# EAGLE design TREM_STM (EAGLE 9.2.2)
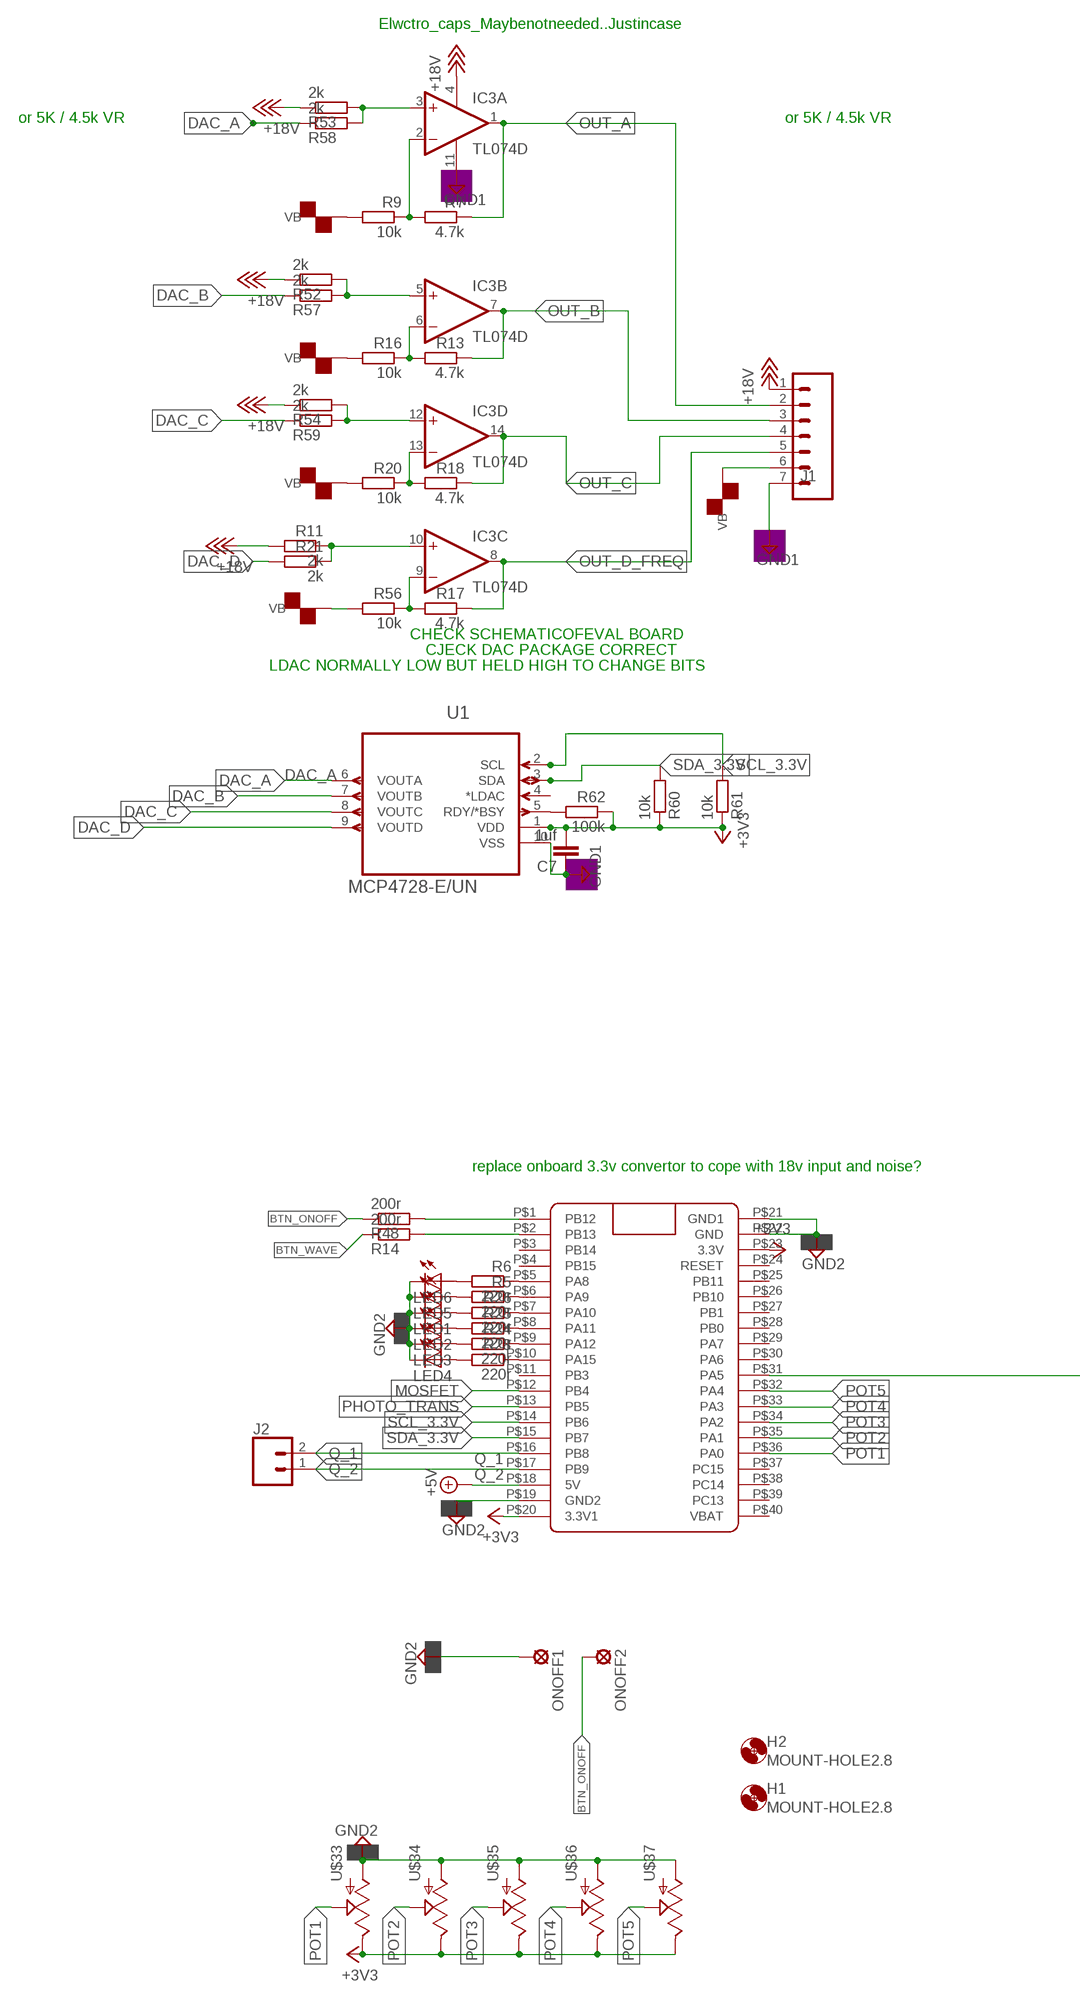
[diagram p0: schematic, sheet 1, part 1 of 2]
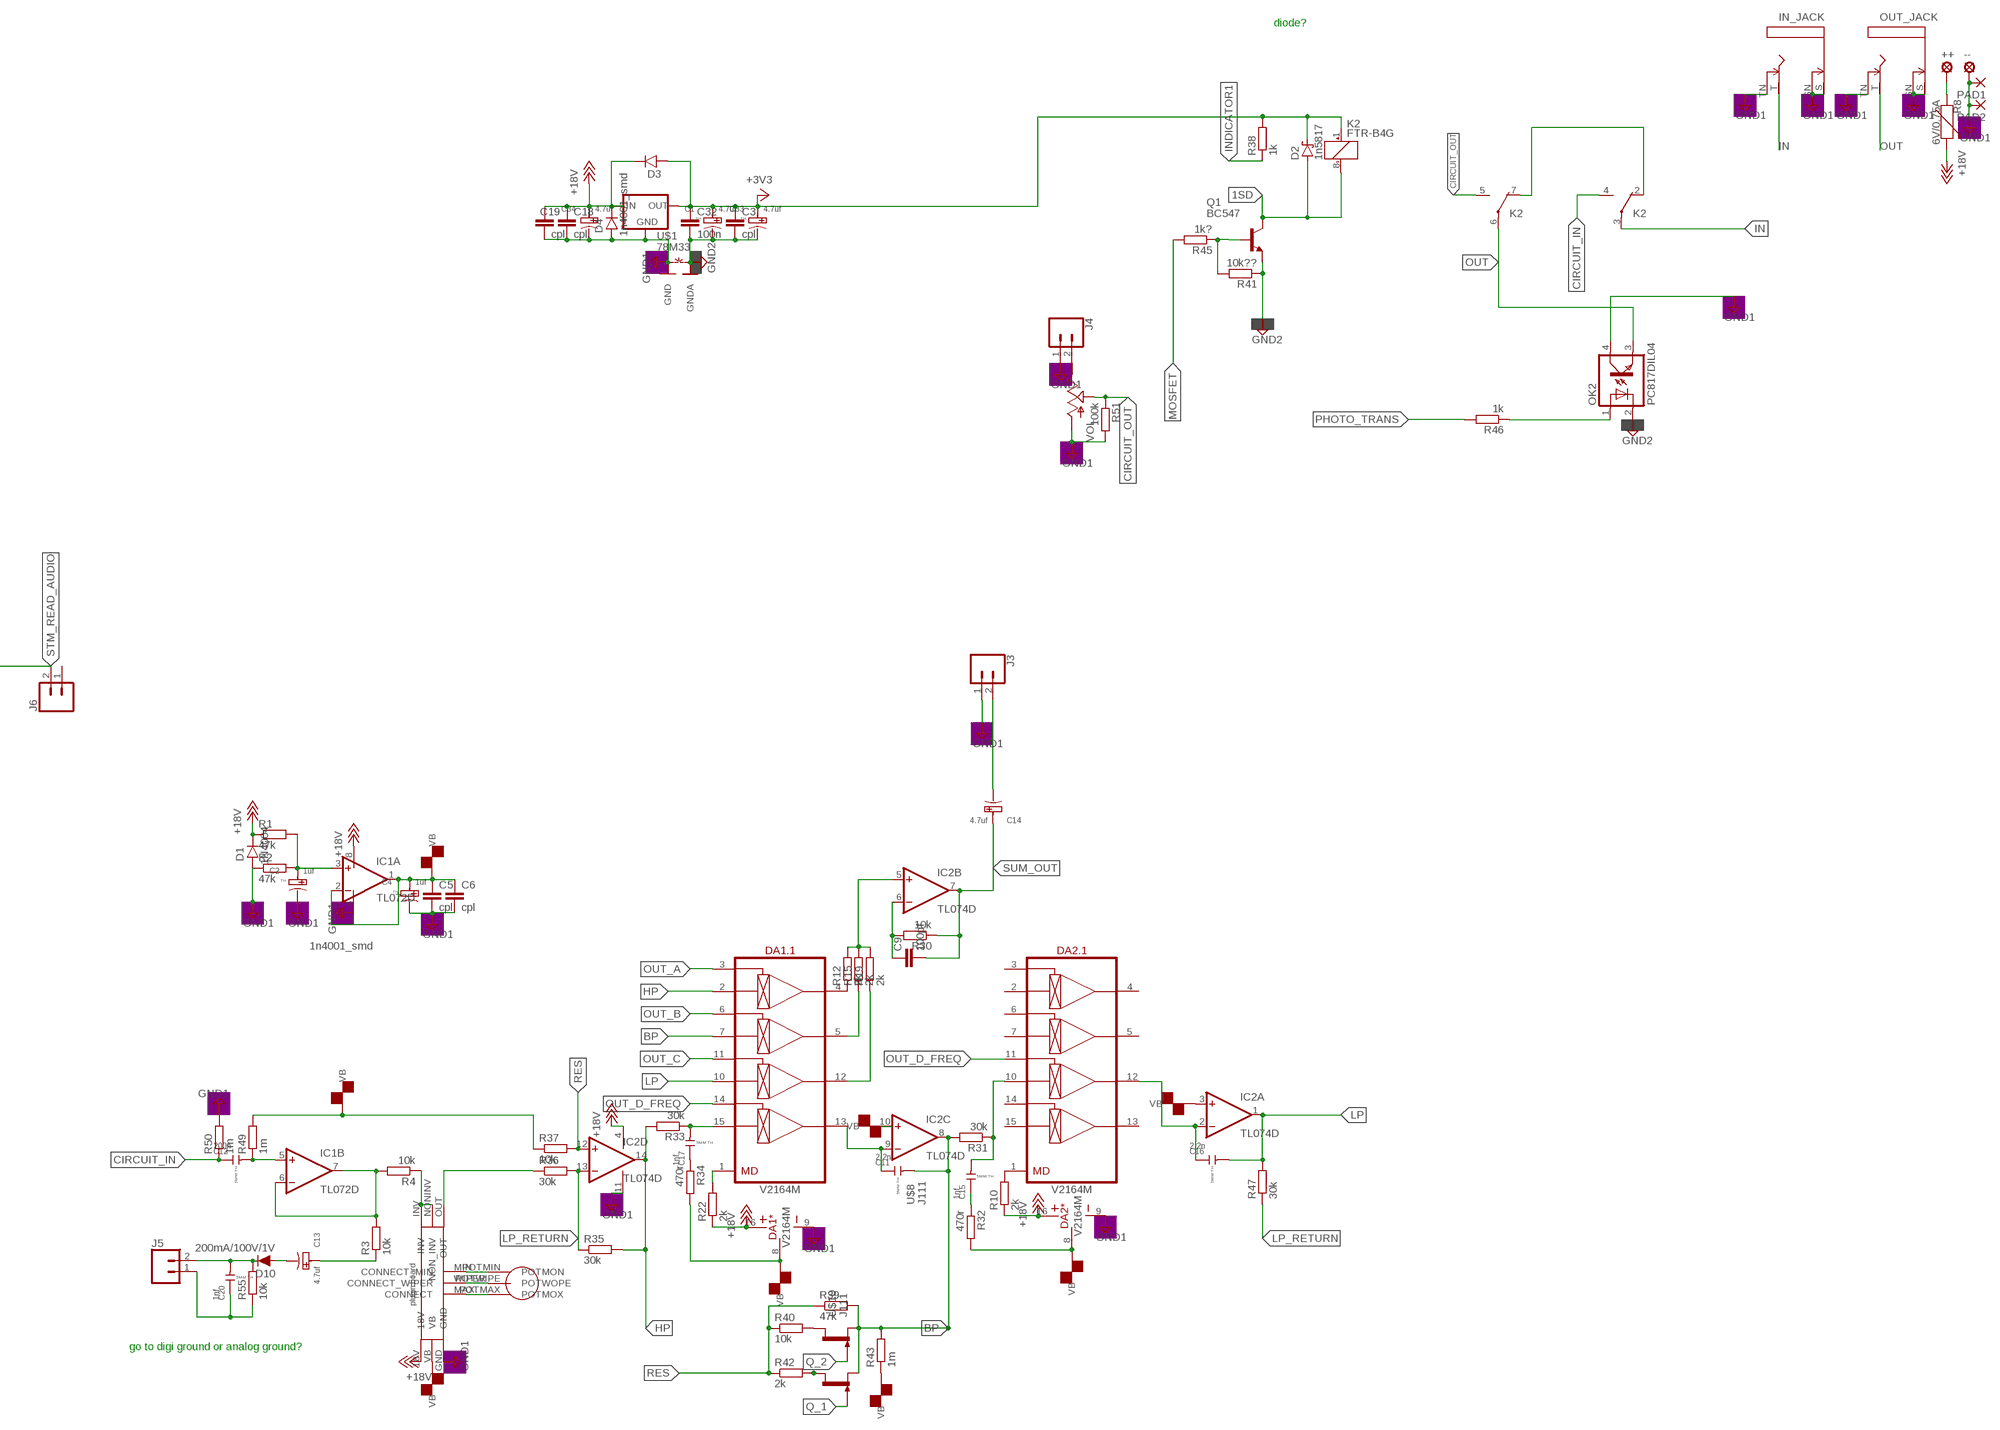
[diagram p1: schematic, sheet 1, part 2 of 2]

## Parts
++  LSP10  [LSP10]
--  LSP10  [LSP10]
C1  4.7uf  THRU-HOLE-POLARIZED  [PC-D5.3MM]
C2  1uf  THRU-HOLE-POLARIZED  [PC-D5.3MM]
C3  cpl  C-EUC1206  [C1206]
C4  1uf  THRU-HOLE-POLARIZED  [PC-D5.3MM]
C5  cpl  C-EUC1206  [C1206]
C6  cpl  C-EUC1206  [C1206]
C7  1uf  C-EUC1206  [C1206]
C9  100pf  C-EUC1206  [C1206]
C11  2.2n  THRU_HOLE_5MM_SPACING  [CERAMIC-5MM]
C12  200n  THRU_HOLE_5MM_SPACING  [CERAMIC-5MM]
C13  4.7uf  THRU-HOLE-POLARIZED  [PC-D5.3MM]
C14  4.7uf  THRU-HOLE-POLARIZED  [PC-D5.3MM]
C15  1nf  THRU_HOLE_5MM_SPACING  [CERAMIC-5MM]
C16  2.2n  THRU_HOLE_5MM_SPACING  [CERAMIC-5MM]
C17  1nf  THRU_HOLE_5MM_SPACING  [CERAMIC-5MM]
C18  cpl  C-EUC1206  [C1206]
C19  cpl  C-EUC1206  [C1206]
C20  1nf  THRU_HOLE_5MM_SPACING  [CERAMIC-5MM]
C32  100n  C-EUC1206  [C1206]
C33  4.7uf  THRU-HOLE-POLARIZED  [PC-D5.3MM]
C34  4.7uf  THRU-HOLE-POLARIZED  [PC-D5.3MM]
D1  1N4004  1N400X.1  [DO41-1]
D2  1n5817  SCHOTTKY-DIODESMD  [SMB]
D3  1n4001_smd  1N400X.1  [DO41-1]
D4  1n4001_smd  1N400X.1  [DO41-1]
D10  200mA/100V/1V  DIODE-1N4148  [DIODE-1N4148]
DA1  V2164M  [SO-16]
DA2  V2164M  [SO-16]
H1  MOUNT-HOLE2.8  [2,8]
H2  MOUNT-HOLE2.8  [2,8]
IC1  TL072D  [SO08]
IC2  TL074D  [SO14]
IC3  TL074D  [SO14]
IN_JACK  MMMONNNNOHOLES  [MONONOHOLES]
J1  CONN_07LONGPADS  [1X07_LONGPADS]
J2  CONN_02PTH3  [1X02_LONGPADS]
J3  CONN_02PTH3  [1X02_LONGPADS]
J4  CONN_02PTH3  [1X02_LONGPADS]
J5  CONN_02PTH3  [1X02_LONGPADS]
J6  CONN_02PTH3  [1X02_LONGPADS]
K2  FTR-B4G  [FTR-B4G]
LED1  LED3MM  [LED3MM]
LED2  LED3MM  [LED3MM]
LED3  LED3MM  [LED3MM]
LED4  LED3MM  [LED3MM]
LED5  LED3MM  [LED3MM]
LED6  LED3MM  [LED3MM]
OK2  PC817DIL04  [SMD4]
ONOFF1  LSP10  [LSP10]
ONOFF2  LSP10  [LSP10]
OUT_JACK  MMMONNNNOHOLES  [MONONOHOLES]
PAD1  SMD5  [SMD2,54-5,08]
PAD2  SMD5  [SMD2,54-5,08]
Q1  BC547  [TO92]
R1  47k  R-EU_M1206  [M1206]
R2  47k  R-EU_M1206  [M1206]
R3  10k  R-EU_M1206  [M1206]
R4  10k  R-EU_M1206  [M1206]
R5  220r  R-EU_M1206  [M1206]
R6  220r  R-EU_M1206  [M1206]
R7  4.7k  R-EU_M1206  [M1206]
R8  6V/0.75A  PPTC_THREE-QUARTER-AMP  [1206]
R9  10k  R-EU_M1206  [M1206]
R10  2k  R-EU_M1206  [M1206]
R11  2k  R-EU_M1206  [M1206]
R12  2k  R-EU_M1206  [M1206]
R13  4.7k  R-EU_M1206  [M1206]
R14  200r  R-EU_M1206  [M1206]
R15  2k  R-EU_M1206  [M1206]
R16  10k  R-EU_M1206  [M1206]
R17  4.7k  R-EU_M1206  [M1206]
R18  4.7k  R-EU_M1206  [M1206]
R19  2k  R-EU_M1206  [M1206]
R20  10k  R-EU_M1206  [M1206]
R21  2k  R-EU_M1206  [M1206]
R22  2k  R-EU_M1206  [M1206]
R23  220r  R-EU_M1206  [M1206]
R24  220r  R-EU_M1206  [M1206]
R25  220r  R-EU_M1206  [M1206]
R26  220r  R-EU_M1206  [M1206]
R30  10k  R-EU_M1206  [M1206]
R31  30k  R-EU_M1206  [M1206]
R32  470r  R-EU_M1206  [M1206]
R33  30k  R-EU_M1206  [M1206]
R34  470r  R-EU_M1206  [M1206]
R35  30k  R-EU_M1206  [M1206]
R36  30k  R-EU_M1206  [M1206]
R37  10k  R-EU_M1206  [M1206]
R38  1k  R-EU_M1206  [M1206]
R39  47k  R-EU_M1206  [M1206]
R40  10k  R-EU_M1206  [M1206]
R41  10k??  R-EU_M1206  [M1206]
R42  2k  R-EU_M1206  [M1206]
R43  1m  R-EU_M1206  [M1206]
R45  1k?  R-EU_M1206  [M1206]
R46  1k  R-EU_M1206  [M1206]
R47  30k  R-EU_M1206  [M1206]
R48  200r  R-EU_M1206  [M1206]
R49  1m  R-EU_M1206  [M1206]
R50  1m  R-EU_M1206  [M1206]
R51  100k  R-EU_M1206  [M1206]
R52  2k  R-EU_M1206  [M1206]
R53  2k  R-EU_M1206  [M1206]
R54  2k  R-EU_M1206  [M1206]
R55  10k  R-EU_M1206  [M1206]
R56  10k  R-EU_M1206  [M1206]
R57  2k  R-EU_M1206  [M1206]
R58  2k  R-EU_M1206  [M1206]
R59  2k  R-EU_M1206  [M1206]
R60  10k  R-EU_M1206  [M1206]
R61  10k  R-EU_M1206  [M1206]
R62  100k  R-EU_M1206  [M1206]
U1  MCP4728-E/UN  [SOP50P490X110-10N]
U$1  78M33  [SOT223]
U$8  J111  [TO92-]
U$10  J111  [TO92-]
U$11  BLUE_PILL  [BLUE_PILL]
U$32  GT_PLUGIN  [PLUGIN_RECIEVE]
U$33  POT  [ALPS_POT]
U$34  POT  [ALPS_POT]
U$35  POT  [ALPS_POT]
U$36  POT  [ALPS_POT]
U$37  POT  [ALPS_POT]
VOL  POT  [ALPS_POT]
~NUDEV~1  GND-GNDA1,27MM  [GND-GNDA-1,27MM]

## Nets
1SD: D2.A K2.8(K:-) Q1.3(C)
+3V3: C1.+ C3.1 C7.2 C32.1 C33.+ D2.C D3.A K2.1(K:+) R38.2 R60.1 R61.1 R62.1 U1.1(VDD) U$1.3(OUT) U$11.P$20(3.3V1) U$11.P$23(3.3V) U$33.P$1(E) U$34.P$1(E) U$35.P$1(E) U$36.P$1(E) U$37.P$1(E)
+5V: U$11.P$18(5V)
+18V: C18.1 C19.1 C34.+ D1.C D3.C D4.C DA1.16(*:V+) DA2.16(*:V+) IC1.8(P:V+) IC2.4(P:V+) IC3.4(P:V+) J1.1 R1.1 R8.2 R10.1 R11.2 R22.1 R52.1 R53.1 R54.1 U$1.1(IN) U$32.18V
BP: C11.2 DA1.7(.1:IN2) IC2.8(C:OUT) R31.2 R39.2 R43.2 U$8.2(S) U$10.2(S)
BTN_ONOFF: ONOFF2.MP R48.1
BTN_WAVE: R14.1
CIRCUIT_IN: C12.1 K2.4(-1:S) R50.1
CIRCUIT_OUT: K2.5(-2:S) R51.1 VOL.P$2(S)
DAC_A: R58.1 U1.6(VOUTA)
DAC_B: R57.1 U1.7(VOUTB)
DAC_C: R59.1 U1.8(VOUTC)
DAC_D: R21.2 U1.9(VOUTD)
GND1: --.MP C2.- C4.- C5.2 C6.2 C7.1 C18.2 C19.2 C34.- D1.A D4.A DA1.9(*:V-) DA2.9(*:V-) IC1.4(P:V-) IC2.11(P:V-) IC3.11(P:V-) IN_JACK.S IN_JACK.SN IN_JACK.TN J1.7 J3.1 J4.1 OK2.4(COL) OUT_JACK.S OUT_JACK.SN OUT_JACK.TN PAD1.1(P) PAD2.1(P) R2.1 R50.2 U1.10(VSS) U$1.2(GND) U$1.4(GND) U$32.GND ~NUDEV~1.GND
GND2: C1.- C3.2 C32.2 C33.- LED1.K(C) LED2.K(C) LED3.K(C) LED4.K(C) LED5.K(C) LED6.K(C) OK2.2(C) ONOFF1.MP Q1.1(E) R41.1 U$11.P$19(GND2) U$11.P$21(GND1) U$11.P$22(GND) U$33.P$3(A) U$34.P$3(A) U$35.P$3(A) U$36.P$3(A) U$37.P$3(A) ~NUDEV~1.GNDA
HP: DA1.2(.1:IN1) IC2.14(D:OUT) R33.2 R35.2
IN: IN_JACK.T K2.3(-1:P)
INDICATOR1: R38.1
LP: C16.2 DA1.10(.1:IN3) IC2.1(A:OUT) R47.2
LP_RETURN: IC2.13(D:-IN) R35.1 R36.2 R47.1
MOSFET: R45.2 U$11.P$12(PB4)
N$1: IC3.2(A:-IN) R7.2 R9.1
N$2: C2.+ IC1.3(A:+IN) R1.2 R2.2
N$3: DA1.1(.1:MD) R22.2
N$4: IC3.3(A:+IN) R53.2 R58.2
N$5: IC3.5(B:+IN) R52.2 R57.2
N$6: IC3.6(B:-IN) R13.2 R16.1
N$7: DA2.1(.1:MD) R10.2
N$8: IC3.12(D:+IN) R54.2 R59.2
N$9: IC3.10(C:+IN) R11.1 R21.1
N$10: IC3.13(D:-IN) R18.2 R20.1
N$11: DA1.4(.1:OUT1) R12.1
N$12: R62.2 U1.5(RDY/*BSY)
N$13: IC3.9(C:-IN) R17.2 R56.1
N$14: DA1.5(.1:OUT2) R15.1
N$15: DA1.12(.1:OUT3) R19.1
N$16: IC1.6(B:-IN) IC1.7(B:OUT) R3.2 R4.2
N$17: R23.1 U$11.P$10(PA15)
N$18: R24.1 U$11.P$9(PA12)
N$19: R25.1 U$11.P$8(PA11)
N$20: IC2.5(B:+IN) R12.2 R15.2 R19.2
N$21: C9.1 IC2.6(B:-IN) R30.2
N$22: R26.1 U$11.P$7(PA10)
N$23: R36.1 U$32.OUT
N$24: C11.1 DA1.13(.1:OUT4) IC2.9(C:-IN)
N$25: R40.2 U$10.3(D)
N$26: C15.2 DA2.10(.1:IN3) R31.1
N$27: C15.1 R32.1
N$28: C16.1 DA2.12(.1:OUT3) IC2.2(A:-IN)
N$29: R42.2 U$8.3(D)
N$30: C17.2 DA1.15(.1:IN4) R33.1
N$31: LED1.A R26.2
N$32: R4.1 U$32.INV U$32.NONINV(NON_INV)
N$33: U$32.MIN(CONNECT_MIN) U$32.POTMIN(POTMON)
N$34: U$32.POTWIPE(POTWOPE) U$32.WIPER(CONNECT_WIPER)
N$35: U$32.MAX(CONNECT) U$32.POTMAX(POTMOX)
N$36: LED2.A R25.2
N$37: K2.2(-1:O) K2.7(-2:O)
N$38: LED3.A R24.2
N$39: LED4.A R23.2
N$40: J4.2 VOL.P$1(E)
N$41: ++.MP R8.1
N$42: C17.1 R34.1
N$43: C12.2 IC1.5(B:+IN) R49.1
N$44: C13.- D10.A
N$45: R51.2 VOL.P$3(A) ; supply symbol labelled GND1
N$46: C13.+ R3.1
N$47: R48.2 U$11.P$1(PB12)
N$48: R14.2 U$11.P$2(PB13)
N$49: R5.1 U$11.P$6(PA9)
N$50: R6.1 U$11.P$5(PA8)
N$51: LED5.A R5.2
N$52: LED6.A R6.2
N$53: C20.1 J5.1 R55.1
N$84: Q1.2(B) R41.2 R45.1
N$88: OK2.1(A) R46.1
OUT: K2.6(-2:P) OK2.3(EMIT) OUT_JACK.T
OUT_A: DA1.3(.1:CV1) IC3.1(A:OUT) J1.2 R7.1
OUT_B: DA1.6(.1:CV2) IC3.7(B:OUT) J1.3 R13.1
OUT_C: DA1.11(.1:CV3) IC3.14(D:OUT) J1.4 R18.1
OUT_D_FREQ: DA1.14(.1:CV4) DA2.11(.1:CV3) IC3.8(C:OUT) J1.5 R17.1
PHOTO_TRANS: R46.2 U$11.P$13(PB5)
POT1: U$11.P$36(PA0) U$33.P$2(S)
POT2: U$11.P$35(PA1) U$34.P$2(S)
POT3: U$11.P$34(PA2) U$35.P$2(S)
POT4: U$11.P$33(PA3) U$36.P$2(S)
POT5: U$11.P$32(PA4) U$37.P$2(S)
Q_1: J2.2 U$8.1(G) U$11.P$16(PB8)
Q_2: J2.1 U$10.1(G) U$11.P$17(PB9)
READ: C14.- J3.2
RES: IC2.12(D:+IN) R37.2 R39.1 R40.1 R42.1
SCL_3.3V: R61.2 U1.2(SCL) U$11.P$14(PB6)
SDA_3.3V: R60.2 U1.3(SDA) U$11.P$15(PB7)
STM_READ_AUDIO: C20.2 D10.C J5.2 J6.2 R55.2 U$11.P$31(PA5)
SUM_OUT: C9.2 C14.+ IC2.7(B:OUT) R30.1
VB: C4.+ C5.1 C6.1 DA1.8(*:GND) DA2.8(*:GND) IC1.1(A:OUT) IC1.2(A:-IN) IC2.3(A:+IN) IC2.10(C:+IN) J1.6 R9.2 R16.2 R20.2 R32.2 R34.2 R37.1 R43.1 R49.2 R56.2 U$32.VB
Unconnected: DA2.2(.1:IN1) DA2.3(.1:CV1) DA2.4(.1:OUT1) DA2.5(.1:OUT2) DA2.6(.1:CV2) DA2.7(.1:IN2) DA2.13(.1:OUT4) DA2.14(.1:CV4) DA2.15(.1:IN4) J6.1 U1.4(*LDAC) U$11.P$3(PB14) U$11.P$4(PB15) U$11.P$11(PB3) U$11.P$24(RESET) U$11.P$25(PB11) U$11.P$26(PB10) U$11.P$27(PB1) U$11.P$28(PB0) U$11.P$29(PA7) U$11.P$30(PA6) U$11.P$37(PC15) U$11.P$38(PC14) U$11.P$39(PC13) U$11.P$40(VBAT)

## Notes on the sheet
- Elwctro_caps_Maybenotneeded..Justincase
- or 5K / 4.5k VR | or 5K / 4.5k VR
- diode?
- CHECK SCHEMATICOFEVAL BOARD
- CJECK DAC PACKAGE CORRECT
- LDAC NORMALLY LOW BUT HELD HIGH TO CHANGE BITS
- replace onboard 3.3v convertor to cope with 18v input and noise?
- go to digi ground or analog ground?

## Library data of the parts
++ -- ONOFF1 ONOFF2 = solpad:LSP10: SOLDER PAD drill 1.0 mm, distributor Buerklin, 12H555
C1 C2 C4 C13 C14 C33 C34 = GT_Capacitor:THRU-HOLE-POLARIZED: 302030033; PACKAGE: TH
C3 C5-C7 C9 C18 C19 C32 = resistor:C-EU: CAPACITOR, European symbol
C11 C12 C15-C17 C20 = GT_Capacitor:THRU_HOLE_5MM_SPACING: 302010202; PACKAGE: 5MM TH
D1 D3 D4 = gm-diodes:1N400X: Rectifier Diodes often used in power supply to prevent damage from reverse polarization
D2 = diode:SCHOTTKY-DIODE: Schottky Diode
D10 = SparkFun-DiscreteSemi:DIODE: Diode These are standard reverse protection diodes and small signal diodes. SparkFun Products: SparkFun SparkPunk Sound Kit <https://www.sparkfun.com/products/11177> SparkFun ESP8266 Thing <https://www.sparkfun.com/products/13231>; PROD_ID: DIO-08378
DA1 DA2 = ic-coolaudio:V2164
H1 H2 = holes:MOUNT-HOLE: MOUNTING HOLE with drill center marker
IC1 = linear:TL072: OP AMP
IC2 IC3 = linear:TL074: OP AMP
IN_JACK OUT_JACK = gm-jacks2:MMMONNN
J1 = GT_Connectors:CONN_07: Multi connection point. Often used as Generic Header-pin footprint for 0.1 inch spaced/style header connections On any of the 0.1 inch spaced packages, you can populate with these: Break Away Headers - Straight <https://www.sparkfun.com/products/116> (PRT-00116) Break Away Male Headers - Right Angle <https://www.sparkfun.com/products/553> (PRT-00553) Female Headers <https://www.sparkfun.com/products/115> (PRT-00115) Break Away Headers - Machine Pin <https://www.sparkfun.com/products/117> (PRT-00117) Break Away Female Headers - Swiss Machine Pin <https://www.sparkfun.com/products/743> (PRT-00743) For SCREWTERMINALS and SPRING TERMINALS visit here: Screw Terimnals on SparkFun.com <https://www.sparkfun.com/search/results?term=Screw+Terminals> (5mm/3.5mm/2.54mm spacing) This device is also useful as a general connection point to wire up your design to another part of your project. Our various solder wires solder well into these plated through hole pads. Hook-Up Wire - Assortment (Stranded, 22 AWG) <https://www.sparkfun.com/products/11375> (PRT-11375) Hook-Up Wire - Assortment (Solid Core, 22 AWG) <https://www.sparkfun.com/products/11367> (PRT-11367) View the entire wire category on our website here <https://www.sparkfun.com/categories/141> Special notes: Molex polarized connector foot print use with SKU : PRT-08231 with associated crimp pins and housings. 1MM SMD Version SKU: PRT-10208 NOTES ON THE VARIANTS LOCK and LOCK_LONGPADS... This footprint was designed to help hold the alignment of a through-hole component (i.e. 6-pin header) while soldering it into place. You may notice that each hole has been shifted either up or down by 0.005 of an inch from it's more standard position (which is a perfectly straight line). This slight alteration caused the pins (the squares in the middle) to touch the edges of the holes. Because they are alternating, it causes a "brace" to hold the component in place. 0.005 has proven to be the perfect amount of "off-center" position when using our standard breakaway headers. Although looks a little odd when you look at the bare footprint, once you have a header in there, the alteration is very hard to notice. Also,if you push a header all the way into place, it is covered up entirely on the bottom side.
J2-J6 = GT_Connectors:CONN_02: Multi connection point. Often used as Generic Header-pin footprint for 0.1 inch spaced/style header connections On any of the 0.1 inch spaced packages, you can populate with these: Break Away Headers - Straight <https://www.sparkfun.com/products/116> (PRT-00116) Break Away Male Headers - Right Angle <https://www.sparkfun.com/products/553> (PRT-00553) Female Headers <https://www.sparkfun.com/products/115> (PRT-00115) Break Away Headers - Machine Pin <https://www.sparkfun.com/products/117> (PRT-00117) Break Away Female Headers - Swiss Machine Pin <https://www.sparkfun.com/products/743> (PRT-00743) For SCREWTERMINALS and SPRING TERMINALS visit here: Screw Terimnals on SparkFun.com <https://www.sparkfun.com/search/results?term=Screw+Terminals> (5mm/3.5mm/2.54mm spacing) This device is also useful as a general connection point to wire up your design to another part of your project. Our various solder wires solder well into these plated through hole pads. Hook-Up Wire - Assortment (Stranded, 22 AWG) <https://www.sparkfun.com/products/11375> (PRT-11375) Hook-Up Wire - Assortment (Solid Core, 22 AWG) <https://www.sparkfun.com/products/11367> (PRT-11367) View the entire wire category on our website here <https://www.sparkfun.com/categories/141> Special notes: Molex polarized connector foot print use with: PRT-08233 with associated crimp pins and housings. 2.54_SCREWTERM for use with PRT-10571. 3.5mm Screw Terminal footprints for PRT-08084 5mm Screw Terminal footprints for use with PRT-08432
K2 = relay:FTR-B4: ULTRA MINIATURE RELAY 2 POLES - 2 A (Slim Profile Signal Relay) FUJITSU FTR-B4 SERIES Source: FTR-B4.pdf
LED1-LED6 = GOLDTOOTH_LED:LED: LED OSRAM: - CHIPLED LG R971, LG N971, LY N971, LG Q971, LY Q971, LO R971, LY R971 LH N974, LH R974 LS Q976, LO Q976, LY Q976 LO Q996 - Hyper CHIPLED LW Q18S LB Q993, LB Q99A, LB R99A - SideLED LS A670, LO A670, LY A670, LG A670, LP A670 LB A673, LV A673, LT A673, LW A673 LH A674 LY A675 LS A676, LA A676, LO A676, LY A676, LW A676 LS A679, LY A679, LG A679 - Hyper Micro SIDELED® LS Y876, LA Y876, LO Y876, LY Y876 LT Y87S - SmartLED LW L88C, LW L88S LB L89C, LB L89S, LG L890 LS L89K, LO L89K, LY L89K LS L896, LA L896, LO L896, LY L896 - TOPLED LS T670, LO T670, LY T670, LG T670, LP T670 LSG T670, LSP T670, LSY T670, LOP T670, LYG T670 LG T671, LOG T671, LSG T671 LB T673, LV T673, LT T673, LW T673 LH T674 LS T676, LA T676, LO T676, LY T676, LB T676, LH T676, LSB T676, LW T676 LB T67C, LV T67C, LT T67C, LS T67K, LO T67K, LY T67K, LW E67C LS E67B, LA E67B, LO E67B, LY E67B, LB E67C, LV E67C, LT E67C LW T67C LS T679, LY T679, LG T679 LS T770, LO T770, LY T770, LG T770, LP T770 LB T773, LV T773, LT T773, LW T773 LH T774 LS E675, LA E675, LY E675, LS T675 LS T776, LA T776, LO T776, LY T776, LB T776 LHGB T686 LT T68C, LB T68C - Hyper Mini TOPLED® LB M676 - Mini TOPLED Santana® LG M470 LS M47K, LO M47K, LY M47K Source: http://www.osram.convergy.de LUXEON: - LUMILED® LXK2-PW12-R00, LXK2-PW12-S00, LXK2-PW14-U00, LXK2-PW14-V00 LXK2-PM12-R00, LXK2-PM12-S00, LXK2-PM14-U00 LXK2-PE12-Q00, LXK2-PE12-R00, LXK2-PE12-S00, LXK2-PE14-T00, LXK2-PE14-U00 LXK2-PB12-K00, LXK2-PB12-L00, LXK2-PB12-M00, LXK2-PB14-N00, LXK2-PB14-P00, LXK2-PB14-Q00 LXK2-PR12-L00, LXK2-PR12-M00, LXK2-PR14-Q00, LXK2-PR14-R00 LXK2-PD12-Q00, LXK2-PD12-R00, LXK2-PD12-S00 LXK2-PH12-R00, LXK2-PH12-S00 LXK2-PL12-P00, LXK2-PL12-Q00, LXK2-PL12-R00 Source: www.luxeon.com KINGBRIGHT: KA-3528ASYC Source: www.kingbright.com
OK2 = GT_optocoupler:PC817: SHARP OPTO COUPLER
PAD1 PAD2 = wirepad:SMD5: SMD PAD
Q1 = transistor-npn:BC547*: NPN Transistor
R1-R7 R9-R26 R30-R43 R45-R62 = resistor:R-EU_: RESISTOR, European symbol
R8 = GOLDTOOTH-Fuses:PPTC: Resettable Fuse PPTC Resettable Fuse. Really a sort of resistor with a polymeric positive temperature coefficient whose resistance increases dramatically with an increase in temperature. When heated by the power passing through the resistance rises causing the current to be limited, protecting the circuit. This is achieved by the transition of the polymer from a crystalline to an amorphous state where the conductive carbon separates breaking the conductive pathways found in the cool crystalline structure. When a PPTC cools back down it resumes conducting letting the circuit turn back on. SparkFun Products: SparkFun RedBoard - Programmed with Arduino <https://www.sparkfun.com/products/12757> Pro Micro - 5V/16MHz <https://www.sparkfun.com/products/12640> Arduino Pro 328 - 5V/16MHz <https://www.sparkfun.com/products/10915> MP3 Trigger <https://www.sparkfun.com/products/13720>; PROD_ID: RES-11150
U1 = GD_MCP4728:MCP4728-E/UN: IC, DAC, 12BIT, QUAD; MPN: MCP4728-E/UN; OC_FARNELL: 1800217; OC_NEWARK: 08R1808; PACKAGE: MSOP-10; SUPPLIER: MICROCHIP
U$1 = v-reg-2:78M33
U$8 U$10 = fv1_bingo:J111
U$11 = BluePill:BLUE_PILL
U$32 = BluePill:GT_PLUGIN
U$33-U$37 VOL = SparkFun-Electromechanical:POT
~NUDEV~1 = ground-junctions:GND-GNDA: Connect GND - GNDA without DRC-Error, display layer 53 (54) to make copper (ROUTE) from GND to GNDA Select also layer 53 (54) in CAM-Job!

## Board
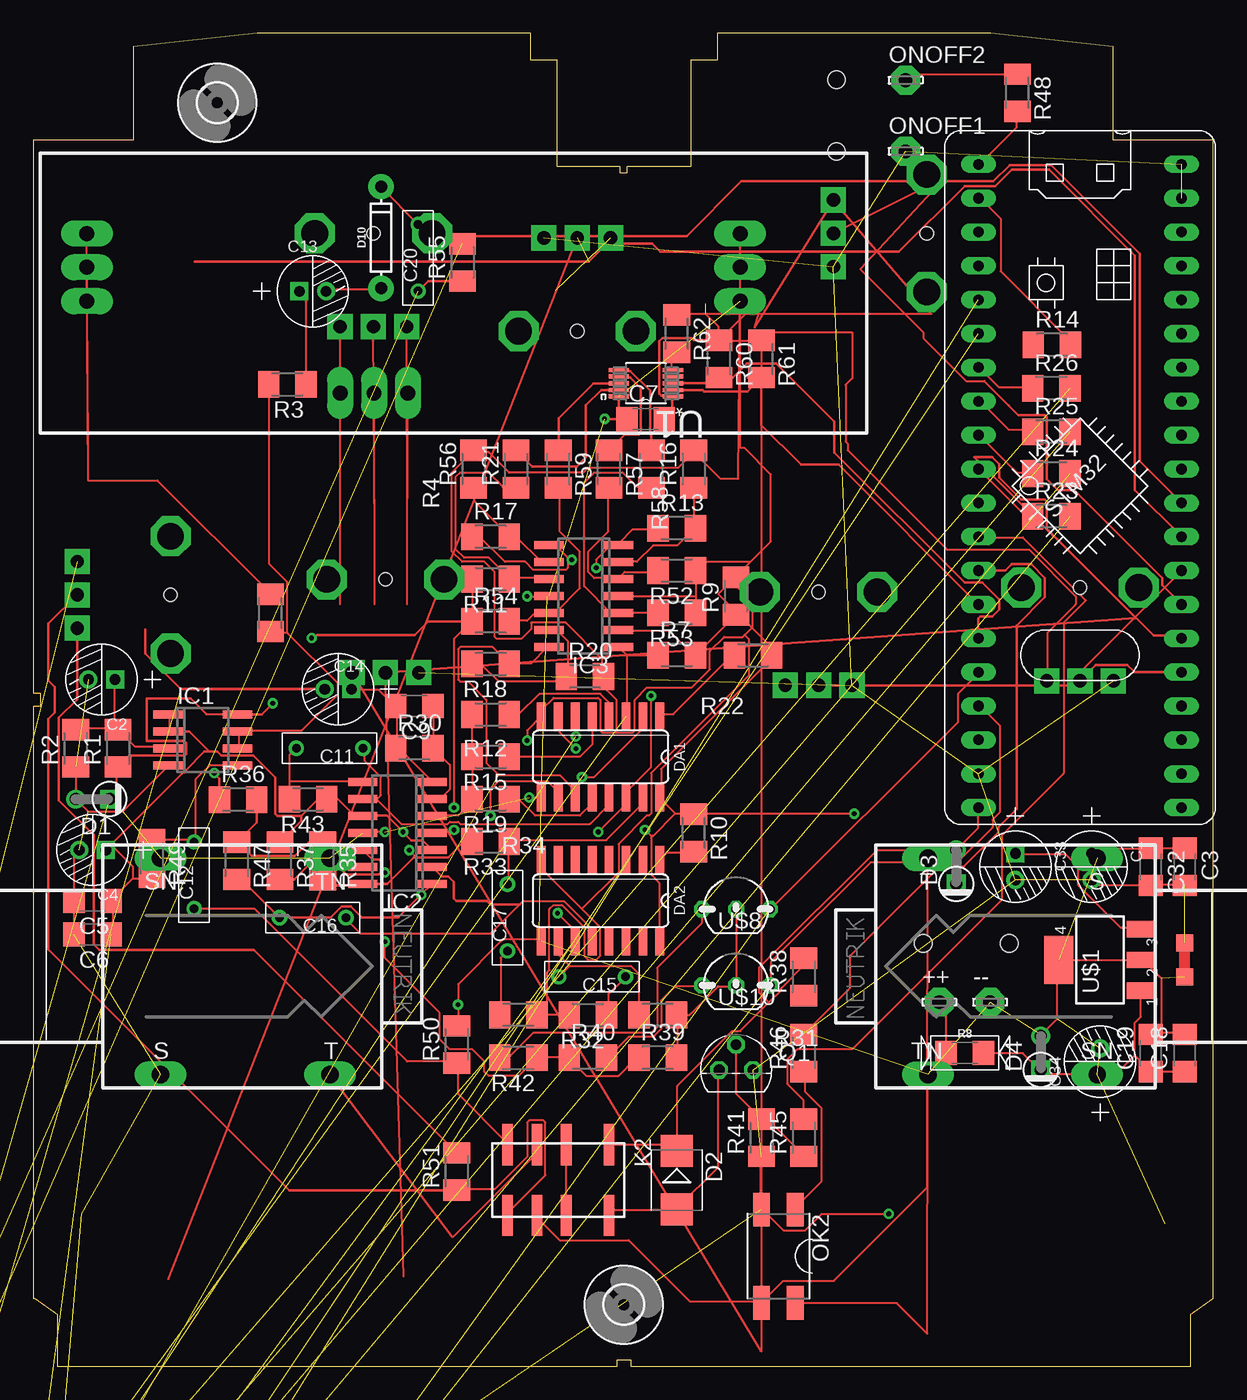
[diagram p2: board, top side]
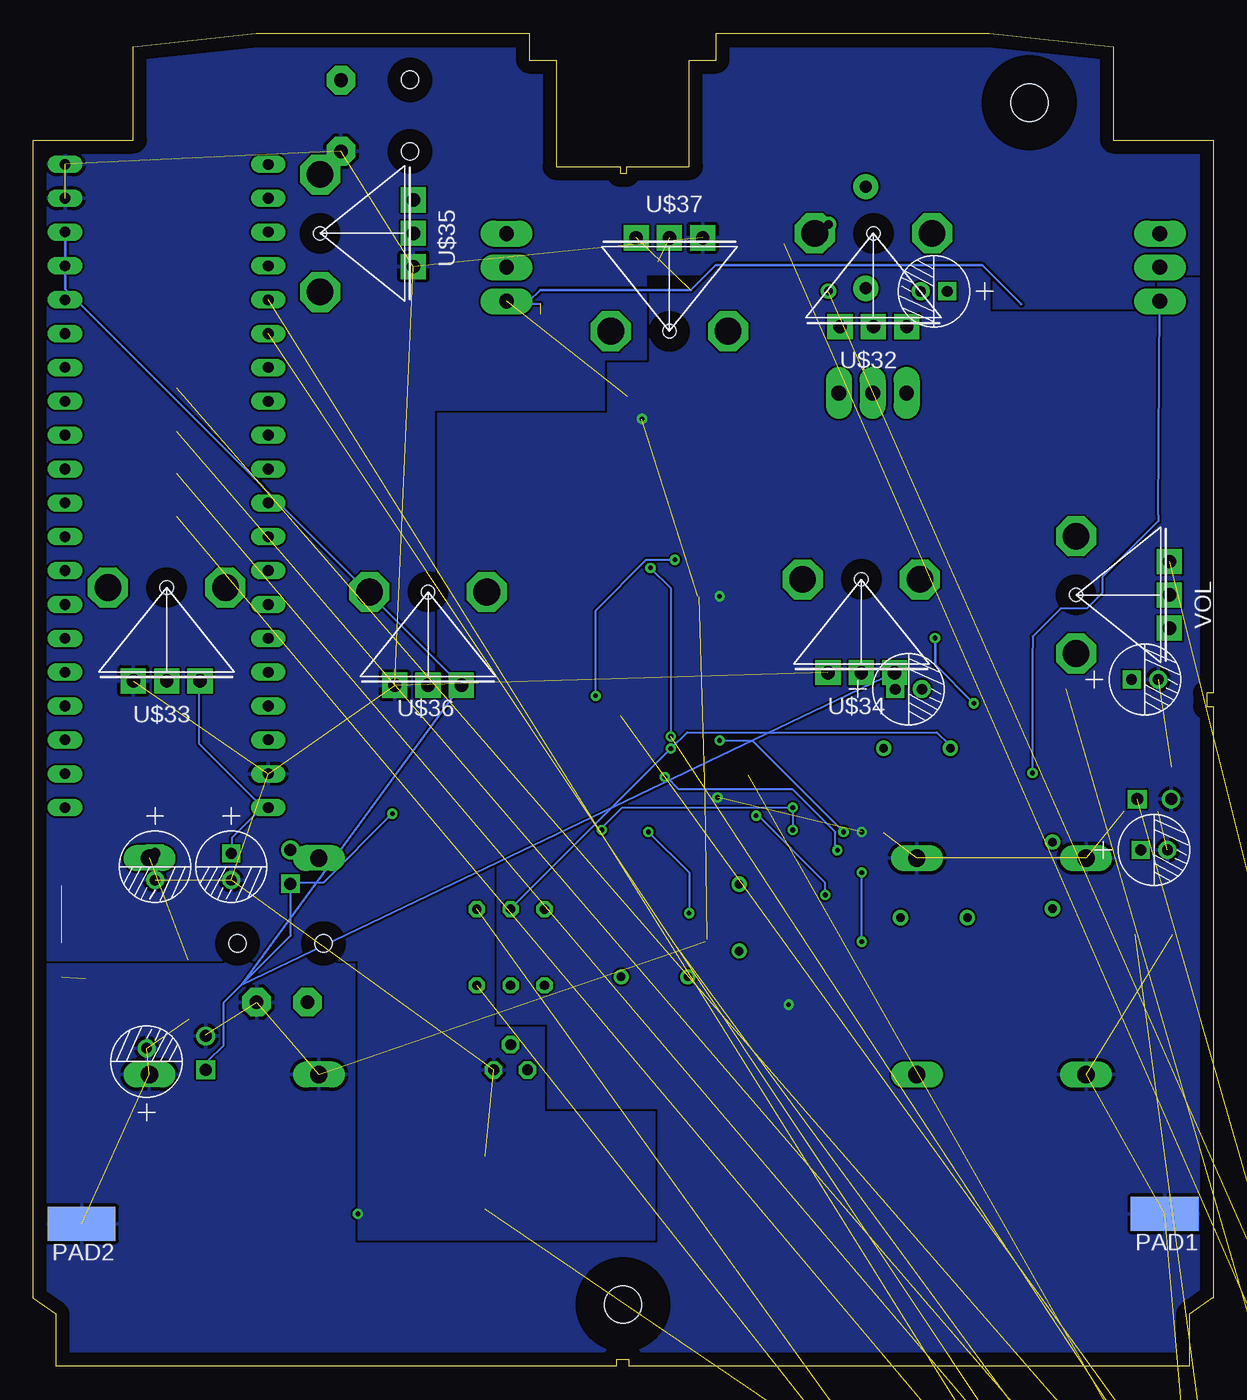
[diagram p3: board, bottom side, seen from below]

Size 88.5 x 100 mm. Coordinates in mm from the lower left corner, seen from the top.
Outline: 88.5,92 81,92 81,99 71.8,100 51.3,100 51.3,98 49.3,98 49.3,90 44.5,90 44.5,89.5 44,89.5 44,90 39.3,90 39.3,98 37.3,98 37.3,100 16.8,100 7.5,99 7.5,92 0,92 0,50.5 0.5,50.5 0.5,49.5 0,49.5 0,5.08 0.11,5.08 1.8,3.89 1.8,0 43.8,0 43.8,0.5 44.8,0.5 44.8,0 86.8,0 86.8,3.89 88.5,5.08 88.5,92
Copper layers (1*16): Top 0.035mm / dielectric 1.5mm / Bottom 0.035mm
Design rules "default": minimum track width 6mil, minimum drill 0.35mm, track to track 6mil, track to pad 6mil, pad to pad 6mil, via to via 6mil, smd to smd 6mil, copper to edge 40mil, drill to drill 6mil, minimum pad ring 10mil, minimum via ring 8mil, stop-mask expansion 4mil, vias tented up to drill 0mil, thermal gap 10mil

### Footprints (pad centres in the part's own frame; a part is rotated, then mirrored left to right if it is on the bottom)
LSP10 = drill 1.016 pad 2.159 octagon: MP 0,0
PC-D5.3MM = drill 0.8 pad 1.35 square: + -1,0 | drill 0.8 pad 1.35: - 1,0
C1206 = smd 1.6 x 1.8: 1 -1.4,0; 2 1.4,0
CERAMIC-5MM = drill 0.635 pad 1.143: 1 -2.5,0; 2 2.5,0
DO41-1 = drill 0.9: A 1.27,0 | drill 0.9 square: C -1.27,0
SMB = smd 2.4 x 2.4: A 2.2,0; C -2.2,0
DIODE-1N4148 = drill 0.9 pad 1.88: A -3.81,0; C 3.81,0
SO-16 = smd 0.66 x 2.032: 1 -4.445,-3.073; 2 -3.175,-3.073; 3 -1.905,-3.073; 4 -0.635,-3.073; 5 0.635,-3.073; 6 1.905,-3.073; 7 3.175,-3.073; 8 4.445,-3.073; 9 4.445,3.073; 10 3.175,3.073; 11 1.905,3.073; 12 0.635,3.073; 13 -0.635,3.073; 14 -1.905,3.073; 15 -3.175,3.073; 16 -4.445,3.073
2,8 = hole 2.8: 0,0
SO08 = smd 0.6 x 2.2: 1 -1.905,-2.6; 2 -0.635,-2.6; 3 0.635,-2.6; 4 1.905,-2.6; 5 1.905,2.6; 6 0.635,2.6; 7 -0.635,2.6; 8 -1.905,2.6
SO14 = smd 0.6 x 2.2: 1 -3.81,-2.6; 2 -2.54,-2.6; 3 -1.27,-2.6; 4 0,-2.6; 5 1.27,-2.6; 6 2.54,-2.6; 7 3.81,-2.6; 8 3.81,2.6; 9 2.54,2.6; 10 1.27,2.6; 11 0,2.6; 12 -1.27,2.6; 13 -2.54,2.6; 14 -3.81,2.6
MONONOHOLES = drill 1.3 long: S 6.35,8.115; SN 6.35,-8.115; T -6.35,8.115; TN -6.35,-8.115
1X07_LONGPADS = drill 1.016 pad 1.88 long: 1 0,0; 2 2.54,0; 3 5.08,0; 4 7.62,0; 5 10.16,0; 6 12.7,0; 7 15.24,0
1X02_LONGPADS = drill 1.118 pad 1.88 long: 1 0,0; 2 2.54,0
FTR-B4G = smd 0.8 x 3.1: 1 -3.8,-2.65; 2 -0.6,-2.65; 3 1.6,-2.65; 4 3.8,-2.65; 5 3.8,2.65; 6 1.6,2.65; 7 -0.6,2.65; 8 -3.8,2.65
LED3MM = drill 0.813 octagon: A -1.27,0; K 1.27,0
SMD4 = smd 1.27 x 2.54: 1 -1.27,-3.5; 2 1.27,-3.5; 3 1.27,3.5; 4 -1.27,3.5
SMD2,54-5,08 = smd 2.54 x 5.08: 1 0,0
TO92 = drill 0.813 octagon: 1 1.27,0; 2 0,1.905; 3 -1.27,0
M1206 = smd 1.6 x 2: 1 -1.4,0; 2 1.4,0
1206 = smd 1.6 x 1.8: 1 -1.4,0; 2 1.4,0
SOP50P490X110-10N = smd 1.524 x 0.33: 1 -2.032,0.991; 2 -2.032,0.508; 3 -2.032,0; 4 -2.032,-0.508; 5 -2.032,-0.991; 6 2.032,-0.991; 7 2.032,-0.508; 8 2.032,0; 9 2.032,0.508; 10 2.032,0.991
SOT223 = smd 1.219 x 2.235: 1 -2.311,-3.099; 2 0,-3.099; 3 2.311,-3.099 | smd 3.6 x 2.2: 4 0,3.099
HOLD = hole 1.3: 0,0
TO92- = drill 0.7 octagon: 1 2.54,0; 2 0,0; 3 -2.54,0
BLUE_PILL = drill 0.8 long: P$1 -7.62,15.24; P$2 -7.62,12.7; P$3 -7.62,10.16; P$4 -7.62,7.62; P$5 -7.62,5.08; P$6 -7.62,2.54; P$7 -7.62,0; P$8 -7.62,-2.54; P$9 -7.62,-5.08; P$10 -7.62,-7.62; P$11 -7.62,-10.16; P$12 -7.62,-12.7; P$13 -7.62,-15.24; P$14 -7.62,-17.78; P$15 -7.62,-20.32; P$16 -7.62,-22.86; P$17 -7.62,-25.4; P$18 -7.62,-27.94; P$19 -7.62,-30.48; P$20 -7.62,-33.02; P$21 7.62,15.24; P$22 7.62,12.7; P$23 7.62,10.16; P$24 7.62,7.62; P$25 7.62,5.08; P$26 7.62,2.54; P$27 7.62,0; P$28 7.62,-2.54; P$29 7.62,-5.08; P$30 7.62,-7.62; P$31 7.62,-10.16; P$32 7.62,-12.7; P$33 7.62,-15.24; P$34 7.62,-17.78; P$35 7.62,-20.32; P$36 7.62,-22.86; P$37 7.62,-25.4; P$38 7.62,-27.94; P$39 7.62,-30.48; P$40 7.62,-33.02
PLUGIN_RECIEVE = drill 1.118 pad 1.956 long: 18V -27.511,0.017; GND -27.511,5.097; INV 21.489,0.017; MAX -2.591,11.989; MIN 2.489,11.989; NONINV 21.489,2.557; OUT 21.489,5.097; VB -27.511,2.557; WIPER -0.051,11.989 | drill 2 octagon: P$4 4.4,0; P$5 -4.4,0 | drill 1 pad 1.88 square: POTMAX -2.5,7; POTMIN 2.5,7; POTWIPE 0,7 | hole 1: 0,0
ALPS_POT = drill 1 pad 1.88 square: P$1 7,-2.5; P$2 7,0; P$3 7,2.5 | drill 2 octagon: P$4 0,-4.4; P$5 0,4.4 | hole 1: 0,0
GND-GNDA-1,27MM = smd 1.27 x 1.27: GND -1.27,0; GNDA 1.27,0

### Placement (x,y rotation side)
++  67.94,27.3 0 top
--  71.75,27.3 0 top
C1  79.38,37.47 270 top
C2  5.13,51.52 180 top
C3  86.36,37.47 270 top
C4  4.45,38.73 180 top
C5  4.45,34.92 180 top
C6  4.45,32.38 180 top
C7  45.91,71.06 0 top
C9  28.57,49.53 180 top
C11  22.23,46.35 180 top
C12  12.06,36.83 90 top
C13  20.95,80.64 0 top
C14  22.86,50.8 180 top
C15  41.91,29.21 180 top
C16  20.95,33.66 180 top
C17  35.56,33.66 90 top
C18  86.36,23.5 90 top
C19  83.82,23.5 90 top
C20  28.86,83.16 90 top
C32  83.82,37.47 270 top
C33  73.66,37.47 270 top
C34  80.01,22.86 90 top
D1  4.45,42.55 180 top
D2  48.26,13.97 270 top
D3  69.22,37.47 90 top
D4  75.56,23.5 90 top
D10  26.08,84.67 90 top
DA1  42.55,45.72 180 top
DA2  42.55,34.92 180 top
H1  44.28,4.62 0 top
H2  13.8,94.79 0 top
IC1  12.7,46.99 270 top
IC2  27.3,40.01 90 top
IC3  41.27,57.78 90 top
IN_JACK  15.89,30 180 top
J1  -15.24,-30.29 0 top  (outside the outline)
J2  -20.6,-67.71 0 top  (outside the outline)
J3  -25.96,-67.71 0 top  (outside the outline)
J4  -31.32,-67.71 0 top  (outside the outline)
J5  -36.68,-67.71 0 top  (outside the outline)
J6  -42.04,-67.71 0 top  (outside the outline)
K2  39.37,13.97 180 top
LED1  -14.86,-34.59 0 top  (outside the outline)
LED2  -14.86,-38.96 0 top  (outside the outline)
LED3  -14.86,-43.33 0 top  (outside the outline)
LED4  -14.86,-47.69 0 top  (outside the outline)
LED5  -14.86,-64.36 0 top  (outside the outline)
LED6  -14.86,-68.73 0 top  (outside the outline)
OK2  55.88,8.26 180 top
ONOFF1  65.43,91.15 0 top
ONOFF2  65.43,96.48 0 top
OUT_JACK  73.44,30 0 top
PAD1  3.64,11.43 90 bottom
PAD2  84.89,10.68 90 bottom
Q1  52.7,22.23 0 top
R1  6.35,46.35 90 top
R2  3.17,46.35 90 top
R3  19.05,73.66 180 top
R4  17.78,56.52 270 top
R5  -14.52,-52.95 0 top  (outside the outline)
R6  -14.52,-59.1 0 top  (outside the outline)
R7  48.26,53.34 0 top
R8  69.85,23.5 0 top
R9  52.7,57.78 90 top
R10  49.53,40.01 270 top
R11  34.29,59.05 180 top
R12  34.29,48.9 180 top
R13  48.26,62.87 0 top
R14  76.4,76.62 0 top
R15  34.29,45.72 180 top
R16  49.53,67.31 90 top
R17  34.29,62.23 0 top
R18  34.29,52.7 180 top
R19  34.29,42.55 180 top
R20  41.37,51.74 0 top
R21  36.2,67.31 90 top
R22  53.98,53.34 180 top
R23  76.35,63.76 0 top
R24  76.35,66.97 0 top
R25  76.35,70.11 0 top
R26  76.35,73.37 0 top
R30  28.57,46.35 0 top
R31  46.83,26.36 0 top
R32  41.59,26.36 180 top
R33  34.29,39.37 180 top
R34  36.39,26.36 0 top
R35  21.71,37.91 270 top
R36  15.35,42.51 0 top
R37  18.51,37.92 270 top
R38  57.78,29.21 90 top
R39  46.83,23.14 0 top
R40  41.59,23.14 0 top
R41  54.61,17.14 90 top
R42  36.39,23.14 180 top
R43  20.6,42.55 180 top
R45  57.78,17.14 90 top
R46  57.78,23.5 90 top
R47  15.26,37.92 270 top
R48  73.8,95.53 270 top
R49  8.89,38.1 270 top
R50  31.75,24.13 90 top
R51  31.75,14.61 90 top
R52  48.26,59.69 180 top
R53  48.26,56.52 180 top
R54  34.29,55.88 0 top
R55  32.19,82.8 90 top
R56  33.02,67.31 90 top
R57  43.18,67.31 270 top
R58  46.35,67.31 270 top
R59  39.37,67.31 270 top
R60  51.44,75.56 270 top
R61  54.61,75.56 270 top
R62  48.26,77.47 270 top
U1  45.94,73.74 180 top
U$1  80.01,30.48 90 top
U$2  [HOLD]  60.24,96.51 0 top
U$3  [HOLD]  60.24,91.14 0 top
U$5  [HOLD]  66.75,31.72 0 top
U$8  52.7,34.29 0 top
U$9  [HOLD]  73.2,31.72 0 top
U$10  52.7,28.57 0 top
U$11  78.5,74.93 0 top
U$32  25.5,85 180 top
U$33  78.5,58.42 270 top
U$34  26.4,59.04 270 top
U$35  67,85 180 top
U$36  58.9,58.09 270 top
U$37  40.8,77.65 90 top
VOL  10.29,57.87 180 top
~NUDEV~1  86.36,30.48 90 top

### Tracks (layer width: path | path; a pad name or v marks a point on that pad's centre or on a via)
1SD
  Top 0.152: K2.8 43.28,11.43 43.59,11.73 48.16,11.73 D2.A 48.31,11.89 51.36,14.94 51.36,22.1 Q1.3
+3V3  (2 unrouted)
  Top 0.152: 55.17,27.28 53.03,25.15 52.43,25.15 48.31,21.03 48.31,16.61 | 55.17,27.28 56.08,28.19 56.08,28.35 57.76,30.02 57.76,30.48 R38.2 | 48.31,16.61 48.31,16.31 D2.C 48.31,16.61 | 48.31,16.61 43.28,16.61 K2.1 | C32.1 86.26,38.86 C3.1 | 78.33,37.49 78.33,36.12 81.53,32.92 83.06,32.92 U$1.3 | 78.33,37.49 79.25,38.41 C1.+ 79.4,38.56 79.7,38.86 C32.1 | C32.1 | 78.33,37.49 77.42,38.41 73.76,38.41 C33.+ | U$11.P$20 70.87,41.91 70.87,40.39 D3.A 69.19,38.71 63.25,38.71 54.41,29.87 54.41,28.04 55.17,27.28 | 86.11,85.04 U$11.P$23 | 50.44,78.94 67.36,78.94 U$35.P$1 54.08,77.92 54.8,80.33 R60.1 | 50.44,78.94 48.31,78.94 R62.1 48.16,78.79 47.7,78.79 | 50.44,78.94 51.36,78.03 51.36,77.11 R60.1 | R61.1 54.56,76.96 51.51,76.96 R60.1 | 47.92,72.8 U1.1 | R61.1 54.61,1.1 U$34.P$1 | R61.1 54.71,77.11 55.17,77.57 61.42,77.57 61.42,74.12 60.92,73.62 60.92,69.38 61.07,69.23 61.07,68.73 68.54,61.27 74.68,61.27 78.18,57.76 78.18,57.15 76.05,55.02 76.05,51.51 U$33.P$1
  Top 0.203: C7.2 47.92,71.66 47.92,72.8 47.91,72.81 47.1,72.81 46.95,72.96 46.95,76.92 47.16,77.12 49.37,77.12 49.52,76.97 R60.1
  Bottom 0.152: 71.29,41.91 76.05,46.67 76.05,51.36 U$33.P$1 | C33.+ 73.61,38.56 73.61,39.62 71.32,41.91 71.29,41.91 | 71.29,41.91 U$11.P$20 | U$34.P$1 72.86,28.62 U$36.P$1 | 51.33,79.9 51.14,79.7 50.44,79.7
  Bottom 0.203: 51.33,79.9 50.48,80.75 39.18,80.75 37.33,82.6 17.33,82.6 14.39,79.66 | U$11.P$23 86.12,80.81 U$36.P$1
+18V  (via drill 0.35)  (1 unrouted)
  Top 0.152: R11.2 32.92,58.98 32.92,55.93 R54.1 32.77,55.78 31.55,54.56 v31.55,41.91 | v31.55,40.23 31.39,40.08 30.02,40.08 IC2.4 | 5.79,42.67 6.25,43.13 6.25,44.81 R1.1 6.25,44.96 | C19.1 86.26,22.1 C18.1 | 82.6,23.32 82.6,25.76 83.06,26.21 83.06,28.04 U$1.1 | C19.1 82.6,23.32 | C19.1 | 80.01,21.95 81.23,21.95 82.6,23.32 | R8.2 71.32,23.47 74.22,23.47 75.44,22.25 D4.C 75.59,22.1 75.74,21.95 80.01,21.95 | 80.01,21.95 C34.+ | 48.16,41.45 49.53,41.45 | 48.16,41.45 47.09,42.52 DA1.16 47.09,42.67 47.09,44.81 55.32,53.03 55.32,53.34 R22.1 55.67,53.63 51.38,57.93 53.8,60.35 | 48.16,41.45 46.48,39.78 | 46.48,39.78 46.33,39.62 46.33,36.88 46.94,36.27 46.94,31.85 DA2.16 | 49.68,57.76 49.68,59.59 R52.1 49.68,59.74 50.29,60.35 53.8,60.35 | 49.68,57.76 49.68,56.54 R53.1 | 49.68,57.76 43.89,57.76 IC3.4 | 53.8,60.35 55.32,61.87 55.32,66.9 53.34,68.89 53.03,68.89 U$32.18V | 49.53,41.45 v61.57,41.45 | 49.53,41.45 R10.1 | v45.87,40.23 46.33,39.78 46.48,39.78 | 12.95,48.92 15.28,48.92 IC1.8
  Top 0.203: R1.1 7.2,45.8 11.3,45.8 11.45,45.95 11.45,46.76 11.3,46.91 8.51,46.91 8.51,50.08 11.79,50.08 12.95,48.92 | D1.C 5.79,42.62 5.79,42.67 | R54.1 29.63,55.88 28.6,54.85 21.28,54.85 20.87,54.44 v20.87,54.63 | v17.96,49.74 17.12,48.9 IC1.8
  Bottom 0.152: v31.55,40.23 v31.55,41.91 44.35,41.91 45.87,40.39 v45.87,40.23 | D4.C 75.44,22.25 75.44,22.86 74.22,24.08 74.22,27.28 69.19,32.31 69.19,36.12 D3.C 69.19,36.27 66.75,36.27 v61.57,41.45
  Bottom 0.203: v20.87,54.63 20.87,52.65 v17.96,49.74
BP  (via drill 0.35)
  Top 0.152: R39.2 48.31,23.16 48.31,26.21 R31.2 48.31,26.36 49.23,26.36 51.36,28.5 52.58,28.5 U$10.2 52.73,28.65 52.73,34.29 U$8.2 | 19.2,43.89 19.2,45.87 19.66,46.33 C11.2 | 19.2,43.89 19.2,42.67 R43.2 | 19.2,43.89 24.69,43.89 IC2.8 | v40.69,46.33 39.47,47.55 39.47,48.77 DA1.7
  Bottom 0.152: U$8.2 52.73,34.29 v40.69,46.33 39.47,47.55 20.73,47.55 19.81,46.63 19.81,46.48 C11.2
BTN_ONOFF
  Top 0.152: R48.1 73.76,96.93 65.84,96.93 65.53,96.62 ONOFF2.MP
CIRCUIT_IN
  Top 0.152: K2.4 35.51,16.76 31.85,20.42 31.85,22.71 R50.1 31.7,22.86 28.04,22.86 16.61,34.29 12.19,34.29 C12.1
CIRCUIT_OUT
  Top 0.152: R51.1 31.85,13.26 34.59,13.26 37.03,15.7 37.03,18.29 37.19,18.44 38.25,18.44 38.41,18.29 38.41,14.33 35.51,11.43 K2.5
  Top 0.203: R51.1 19.19,13.21 1.14,31.26 1.14,48.56 1.62,49.04 1.62,50.96 1.14,51.44 1.14,55.72 VOL.P$2
  Bottom 0.152: 3.81,58.52 3.29,57.93 VOL.P$2
DAC_A
  Top 0.152: U1.6 43.91,74.66 | 46.33,68.73 R58.1
  Top 0.203: U1.6 43.97,74.67 44.77,74.67 46.26,73.18 46.26,70.05 46.35,69.96 R58.1
DAC_B
  Top 0.152: 43.28,68.73 R57.1
  Top 0.203: U1.7 43.99,74.16 44.77,74.16 45.57,73.36 45.57,70.05 45.42,69.9 44.37,69.9 R57.1
DAC_C
  Top 0.152: 39.47,68.73 39.41,68.72 R59.1
  Top 0.203: U1.8 42.01,73.73 39.41,71.14 39.41,68.72
DAC_D
  Top 0.152: 36.27,68.58 R21.2
  Top 0.203: R21.2 37.41,67.5 40.75,67.5 41.45,68.2 41.45,72.1 42.58,73.23 U1.9
GND1  (via drill 0.35)  (23 unrouted)
  Top 0.152: 84.58,24.99 86.26,24.99 C18.2 | 84.58,24.99 83.82,24.99 C19.2 84.58,24.99 | 84.58,24.99 84.58,29.11 83.21,30.48 U$1.2 U$1.4 76.81,30.48 76.81,26.06 75.59,24.84 D4.A | DA2.9 37.95,32 35.2,32 31.85,28.65 v31.85,27.13 31.85,25.6 R50.2 | C6.2 3.05,32.46 3.05,34.9 C5.2 3.05,35.05 3.05,38.41 3.35,38.71 C4.- | R2.1 3.2,44.81 3.2,42.67 D1.A 4.12,41.6 6.71,41.6 10.06,44.96 IC1.4 | v37.19,42.67 38.1,42.67 DA1.9 | v26.36,40.08 24.84,40.08 IC2.11 | v37.03,57.76 38.56,57.76 IC3.11 | OK2.4 57.15,4.72 64.77,4.72 67.06,2.44 OUT_JACK.TN
  Top 0.203: U1.10 43.91,71.67 C7.1 42.86,71.06 v42.85,71.07
  pour Bottom (rank 6): -0.17,99.87 88.73,99.87 88.73,-0.46 -0.17,-0.46
GND2  (via drill 0.35)  (19 unrouted)
  Top 0.152: 83.82,36.12 86.26,36.12 C3.2 | 83.82,36.12 79.7,36.12 79.4,36.42 C1.- | 83.82,36.12 C32.2 | R41.1 54.56,15.7 54.56,11.89 OK2.2 54.71,11.73 56.24,10.21 57.91,10.21 59.13,11.43 v64.16,11.43
  Bottom 0.152: v64.16,11.43 64.14,11.43
  pour Bottom: 88.9,30.48 64.14,30.48 64.14,9.53 41.91,9.53 41.91,19.05 50.16,19.05 50.16,25.4 53.98,25.4 53.98,50.16 58.42,50.16 58.42,71.77 45.68,71.77 45.68,75.56 42.55,75.56 42.55,81.92 16.51,81.92 16.51,79.38 4.45,79.38 4.45,81.92 0,81.92 0,99.06 86.36,99.06 88.9,96.52
HP  (via drill 0.35)
  Top 0.152: 32.92,39.32 R33.2 | DA1.2 45.72,47.85 42.06,44.2 v41.15,44.2 | v28.19,38.71 28.65,38.25 28.65,38.18
  Top 0.203: R35.2 22.14,36.07 24.45,36.07 24.57,36.2 IC2.14 26.54,36.2 28.53,38.18 28.65,38.18 31.11,38.18 32.3,39.37 R33.2
  Bottom 0.152: v41.15,44.2 41,44.2 40.08,43.28 31.55,43.28 28.35,40.08 28.35,38.86 v28.19,38.71
IN
  Top 0.152: K2.3 37.64,16.61 37.64,15.85 31.46,9.67 IN_JACK.T
LP  (via drill 0.35)
  Top 0.152: 15.29,36.4 R47.2 | v34.29,41.3 34.29,43.28 34.9,43.89 38.56,43.89 39.32,43.13 39.32,42.67 DA1.10 | v29.11,35.36 29.09,35.38
  Top 0.203: IC2.1 29.09,35.38 27.36,33.66 24.62,33.66 23.8,34.48 23.11,34.48 22.29,33.66 C16.2 15.59,36.52 R47.2
  Bottom 0.152: v34.29,41.3 34.14,41.3 29.11,36.27 v29.11,35.36
LP_RETURN
  Top 0.152: 15.13,39.29 R47.1 15.29,39.35 15.4,39.47 | 21.57,39.39 R35.1
  Top 0.203: 24.02,37.47 IC2.13 23.55,37.47 R35.1 20.66,39.31 19.61,38.27 16.37,38.27 15.29,39.35 | R47.1 16.75,40.81 R36.2
MOSFET
  Top 0.152: R45.2 57.76,18.59 57.76,19.96 56.54,21.18 56.54,23.01 57.3,23.77 61.42,23.77 72.62,34.98 72.62,39.84 77.27,44.48 77.27,55.78 78.94,57.45 74.22,62.18 71.02,62.18 U$11.P$12
N$1
  Top 0.152: R9.1 52.58,56.24 49.68,53.34 R7.2 49.53,53.34 47.7,55.17 43.89,55.17 IC3.2
N$2
  Top 0.152: 6.1,47.85 6.25,47.85 R1.2 | 6.1,47.85 3.2,47.85 R2.2 | IC1.3 10.06,46.48 7.62,46.48 6.4,47.7 R1.2 | 6.1,47.85 6.1,51.51 C2.+ | 6.1,47.85 R1.2
N$3
  Top 0.152: R22.2 52.43,53.34 48.01,48.92 47.09,48.92 DA1.1
N$4
  Top 0.152: R53.2 46.79,56.54 43.89,56.54 IC3.3 43.74,56.54 43.28,56.54 41.3,58.52 41.3,66.29 42.06,67.06 44.2,67.06 45.26,65.99 46.33,65.99 R58.2
N$5
  Top 0.152: R52.2 46.79,59.59 44.35,59.59 43.89,59.13 IC3.5 43.74,59.13 42.06,59.13 41.6,59.59 41.6,61.11 43.13,62.64 43.13,65.84 R57.2
N$6
  Top 0.152: R16.1 49.53,62.94 R13.2 49.53,62.79 48.31,61.57 46.48,61.57 45.26,60.35 43.89,60.35 IC3.6
N$7
  Top 0.152: DA2.1 47.55,38.56 49.53,38.56 R10.2
N$8
  Top 0.152: R54.2 35.81,55.93 37.03,55.93 37.49,56.39 38.56,56.39 IC3.12 38.71,56.54 39.17,56.54 41,58.37 41,61.11 39.47,62.64 39.47,65.84 R59.2
N$9
  Top 0.152: IC3.10 38.56,59.13 35.81,59.13 R11.1 35.66,59.13 34.14,60.66 32.31,60.66 31.7,61.27 31.7,66.75 32,67.06 34.14,67.06 35.2,65.99 36.12,65.99 R21.1
N$10
  Top 0.152: IC3.13 38.71,55.17 39.32,55.17 40.08,54.41 40.08,51.82 R20.1 39.93,51.66 39.62,51.36 34.9,51.36 33.68,52.58 32.92,52.58 R18.2
N$11
  Top 0.152: R12.1 35.81,48.92 36.42,48.92 37.95,50.44 42.52,50.44 43.13,49.84 43.13,48.92 DA1.4
N$12
  Top 0.152: U1.5 47.85,74.79 47.85,75.74 48.16,76.05 R62.2
N$13
  Top 0.152: IC3.9 38.56,60.35 38.1,60.35 36.27,62.18 35.81,62.18 R17.2 35.66,62.33 33.07,64.92 33.07,65.84 R56.1
N$14
  Top 0.152: R15.1 41,45.72 41.91,46.63 DA1.5
N$15
  Top 0.152: DA1.12 41.91,42.22 41,41.3 37.64,41.3 36.42,42.52 35.81,42.52 R19.1
N$16
  Top 0.152: 19.05,55.02 17.83,55.02 R4.2 | 19.05,55.02 22.86,51.21 22.86,50.44 20.12,47.7 15.39,47.7 IC1.7 15.39,47.55 15.39,46.48 IC1.6 | 19.05,55.02 19.05,58.83 17.68,60.2 17.68,73.61 R3.2
N$17
  Top 0.152: R23.1 74.83,63.86 74.37,63.86 71.02,67.21 U$11.P$10
N$18
  Top 0.152: R24.1 74.83,67.06 73.76,67.06 71.02,69.8 U$11.P$9
N$19
  Top 0.152: R25.1 74.83,70.26 73.15,70.26 71.02,72.39 U$11.P$8
N$20
  Top 0.152: 32.92,45.72 32.92,42.67 R19.2 32.77,42.52 32.77,42.22 31.85,41.3 30.02,41.3 IC2.5 | 32.92,45.72 32.92,48.77 R12.2 | 32.92,45.72 R15.2
N$21
  Top 0.152: C9.1 30.02,49.53 30.02,46.48 R30.2 30.02,46.33 31.24,45.11 31.24,43.28 30.63,42.67 30.02,42.67 IC2.6
N$22
  Top 0.152: R26.1 74.83,73.46 72.39,73.46 71.02,74.83 U$11.P$7
N$23  (via drill 0.35)
  Top 0.203: R36.1 13.95,44.11 v13.56,44.5
  Bottom 0.152: v13.56,44.5 13.56,53.05 13.56,54.75 11.45,56.85 9.48,56.85 8.32,58.02 8.32,59.2 4.12,63.4 4.12,63.86 U$32.OUT
N$24
  Top 0.152: 25.76,42.52 27.58,40.69 31.09,40.69 31.24,40.84 31.85,40.84 32,40.69 41.76,40.69 43.13,42.06 43.13,42.52 DA1.13 | 25.76,42.52 24.84,42.52 IC2.9 25.76,42.52 | 25.76,42.52 26.06,42.82 26.06,44.2 24.84,45.41 24.84,46.33 C11.1
N$25
  Top 0.152: R40.2 43.13,23.16 44.65,24.69 46.48,24.69 47.09,25.3 47.09,27.43 48.16,28.5 50.14,28.5 U$10.3
N$26
  Top 0.152: 40.23,30.02 44.81,30.02 45.41,29.41 45.41,26.36 R31.1 | 40.23,30.02 39.47,29.26 C15.2 | 40.23,30.02 39.47,30.79 39.47,31.85 DA2.10
N$27
  Top 0.152: R32.1 43.13,26.36 43.13,27.89 44.35,29.11 C15.1
N$28
  Top 0.152: DA2.12 41.91,32.77 39.78,34.9 36.73,34.9 36.49,34.66 34.29,32.46 24.54,32.46 23.47,33.53 C16.1 23.32,33.68
  Top 0.203: IC2.2 30.62,36.75 31.11,36.75 31.54,36.32 31.54,35.08 31.72,34.9 34.01,34.9 34.26,34.66 36.49,34.66
N$29
  Top 0.152: R42.2 35.05,23.16 35.66,23.16 37.49,24.99 46.33,24.99 46.79,25.45 46.79,29.87 50.14,33.22 50.14,34.29 U$8.3
N$30
  Top 0.152: C17.2 35.66,36.27 35.66,39.32 R33.1 35.81,39.47 42.98,39.47 45.72,42.22 DA1.15
N$31  (1 unrouted)
N$32
  Top 0.152: R4.1 17.68,58.06 9.3,66.45 4.12,66.45 U$32.NONINV 4.12,66.6 4.12,68.89 U$32.INV
N$33
  Top 0.152: U$32.POTMIN 23.01,62.03 23.01,57.15 U$32.MIN
N$34
  Top 0.152: U$32.POTWIPE 25.6,62.03 25.6,57.15 U$32.WIPER
N$35
  Top 0.152: U$32.POTMAX 28.04,62.03 28.04,57.15 U$32.MAX
N$36  (1 unrouted)
N$37
  Top 0.152: K2.7 39.93,11.43 39.93,16.61 K2.2
N$38  (1 unrouted)
N$39  (1 unrouted)
N$40  (1 unrouted)
N$41
  Top 0.152: ++.MP 68.43,26.82 68.43,23.62 R8.1
N$42
  Top 0.152: R34.1 35.05,26.36 35.05,30.63 35.51,31.09 C17.1
N$43
  Top 0.152: R49.1 8.99,39.47 12.04,39.47 C12.2 12.19,39.47 12.19,44.04 13.26,45.11 15.24,45.11 IC1.5
N$44
  Top 0.152: C13.- 22.1,80.77 25.91,80.77 D10.A
N$45
  Top 0.152: 31.7,16.15 R51.2
  Top 0.203: VOL.P$3 3.29,50.03 1.92,48.66 1.92,42.44 4.52,39.85 4.52,31.66 4.94,31.23 16.52,31.23 R51.2
N$46
  Top 0.152: R3.1 20.42,73.76 20.42,80.16 19.96,80.62 C13.+
N$47
  Top 0.152: R48.2 73.76,94.03 73.76,92.96 71.02,90.22 U$11.P$1
N$48
  Top 0.152: R14.2 77.72,76.66 77.72,76.96 72.54,82.14 72.54,86.11 71.02,87.63 U$11.P$2
N$49  (1 unrouted)
N$50  (1 unrouted)
N$51  (1 unrouted)
N$52  (1 unrouted)
N$53  (1 unrouted)
  Top 0.203: C20.1 29.61,81.4 R55.1
N$84
  Top 0.152: R45.1 57.76,15.85 55.17,18.44 54.71,18.44 R41.2 54.56,18.59 52.73,20.42 52.73,24.08 Q1.2
N$88
  Top 0.152: R46.1 57.91,21.95 57.91,20.57 59.13,19.36 59.13,13.87 57.15,11.89 OK2.1
OUT
  Top 0.152: K2.6 37.64,11.28 39.47,9.45 44.65,9.45 49.23,4.88 54.56,4.88 OK2.3 54.71,4.88 56.24,6.4 60.05,6.4 67.06,13.41 67.06,18.44 OUT_JACK.T
OUT_A  (1 unrouted)
  Top 0.152: 44.5,53.34 R7.1 | 44.5,53.34 43.89,53.95 IC3.1 | 44.5,53.34 44.5,48.92 DA1.3
OUT_B  (via drill 0.35)  (1 unrouted)
  Top 0.152: R13.1 46.79,62.79 44.96,62.79 43.89,61.72 IC3.7 43.74,61.57 43.28,61.57 42.22,60.5 v42.22,59.89 | v40.69,47.24 40.69,48.77 DA1.6
  Bottom 0.152: v40.69,47.24 40.69,58.37 v42.22,59.89
OUT_C  (1 unrouted)
  Top 0.152: IC3.14 38.56,53.95 37.34,52.73 35.81,52.73 R18.1 35.66,52.73 34.44,53.95 32,53.95 31.85,53.8 31.85,51.51 32,51.36 32.61,51.36 33.98,49.99 33.98,45.26 34.9,44.35 39.47,44.35 40.54,43.28 40.54,42.67 DA1.11
OUT_D_FREQ  (via drill 0.35)  (1 unrouted)
  Top 0.152: 40.08,60.5 40.08,60.66 39.17,61.57 38.71,61.57 IC3.8 | 40.08,60.5 40.08,59.89 39.93,59.74 37.49,59.74 36.88,60.35 35.36,60.35 33.53,62.18 32.92,62.18 R17.1 | v39.32,33.98 40.54,32.77 40.54,31.85 DA2.11 | v42.37,40.08 44.35,42.06 44.35,42.52 DA1.14 44.5,42.67 44.5,43.13 46.33,44.96 v46.33,50.29 | v40.39,60.5 40.08,60.5
  Bottom 0.152: v39.32,33.98 39.32,37.03 v42.37,40.08 | v40.39,60.5 42.52,60.5 46.33,56.69 v46.33,50.29
PHOTO_TRANS
  Top 0.152: 72.39,40.46 72.39,40.08 69.8,37.49 67.97,37.49 61.27,30.79 61.27,28.38 R46.2
  Top 0.203: U$11.P$13 72.89,59.69 73.37,60.17 74.83,60.17 75.85,59.15 75.85,57.69 73.75,55.58 73.75,41.81 72.39,40.46
POT1
  Top 0.152: 78.64,51.51 U$33.P$2
  Top 0.203: U$11.P$36 82.59,52.07 82.05,52.61 79.69,52.61 U$33.P$2
  Bottom 0.152: 85.65,52.12 86.11,52.12 U$11.P$36
POT2
  Top 0.152: 27.76,6.74 U$34.P$2
  Top 0.203: U$34.P$2 82.67,56.12 70.57,68.22 71.91,68.22 72.44,67.69 72.44,66.67 74.1,65.01 75.86,65.01 76.01,64.86 76.01,62.83 84.03,54.81 85.92,54.81 U$11.P$35
POT3
  Top 0.152: 73.15,72.08 71.32,73.91 69.95,73.91 66.75,77.11 66.75,77.57 62.03,82.3 68.38,89.22 U$35.P$2
  Top 0.203: U$11.P$34 84.65,58.62 84.65,59.15 78.08,65.72 76.85,65.72 76,66.56 76,71.22 75.86,71.37 73.87,71.37 73.15,72.08
POT4
  Top 0.203: U$11.P$33 77.52,51.09 U$36.P$2
POT5  (1 unrouted)
  Top 0.152: 10.13,6.53 U$37.P$2
  Top 0.203: U$11.P$32 82.61,65.74 82.61,83.33 76.19,89.75 73.37,89.75 72.16,88.54 69.85,88.54 64.91,83.6 47.01,83.6 46.41,84.2 42.99,84.2 41.65,82.86 12.12,82.86
Q_1  (1 unrouted)
  Top 0.152: U$8.1 55.32,34.29 69.34,48.31 69.34,50.44 70.87,51.97 U$11.P$16
Q_2  (1 unrouted)
  Top 0.152: U$10.1 55.32,28.65 55.32,30.33 62.79,37.8 69.3,37.8 71.94,40.44 71.94,41 72.47,41.53 72.47,48.08 71.02,49.53 U$11.P$17
READ  (1 unrouted)
  Top 0.203: 8.41,55.26 8.41,53.45 11.06,50.8 C14.-
RES  (via drill 0.35)
  Top 0.152: R39.1 45.41,23.01 45.11,23.01 43.89,21.79 41.45,21.79 40.23,23.01 R40.1 40.08,23.16 37.8,23.16 R42.1 37.64,23.01 36.42,21.79 34.14,21.79 33.83,22.1 33.83,22.86 32.92,23.77 31.24,23.77 30.48,24.54 30.48,26.52 26.36,30.63 v26.36,31.85 | v26.36,37.03 26.06,37.03 26.05,37.05
  Top 0.203: IC2.12 25.42,38.02 25.91,38.02 26.06,37.87 26.06,37.06 26.05,37.05 25.91,36.91 23.46,36.91 22.81,37.56 20.6,37.56 19.56,36.52 R37.2
  Bottom 0.152: v26.36,31.85 v26.36,37.03
SCL_3.3V
  Top 0.152: 54.56,74.07 54.1,73.61 54.56,74.11 R61.2 54.56,74.07
  Top 0.203: 53.59,74.17 R61.2 54.61,70.62 57.6,67.63 60.4,67.63 U$11.P$14 | U1.2 50.21,73.23 50.33,73.11 53.56,73.11 54.56,74.11
SDA_3.3V
  Top 0.152: 51.36,74.07 R60.2 51.51,74.07 51.97,73.61
  Top 0.203: U1.3 51.01,73.74 R60.2 52.45,74.17 53.51,75.22 55.72,75.22 60.08,70.85 60.08,68.55 69.85,58.78 71.19,58.78 72.44,57.53 72.44,56.77 71.91,56.24 71.02,56.24 70.88,56.11 U$11.P$15
STM_READ_AUDIO  (2 unrouted)
  Top 0.203: U$11.P$31 82.97,67.92 82.97,83.48 76.34,90.11 73.23,90.11 72.01,88.89 53.1,88.89 49.01,84.79 32.78,84.79 R55.2 30.73,85.66 C20.2 26.08,88.45 D10.C
SUM_OUT
  Top 0.152: 27.28,46.48 27.28,49.53 C9.2 27.13,49.53 25.91,50.75 23.93,50.75 C14.+ | 27.28,46.48 29.87,43.89 IC2.7 | 27.28,46.48 R30.1
VB  (via drill 0.35)  (1 unrouted)
  Top 0.152: 24.84,41.15 IC2.10 24.69,41.3 24.45,41.3 24.08,41.3 22.86,42.52 22.1,42.52 R43.1 21.95,42.52 21.9,42.52 21.34,42.52 | C6.1 5.94,32.46 5.94,34.9 C5.1 5.94,35.05 7.47,36.58 | 7.47,36.58 8.84,36.58 R49.2 | IC1.1 10.21,48.77 10.21,47.7 IC1.2 10.21,47.55 | 6.1,38.86 5.49,38.86 C4.+ 6.1,38.86 | 7.47,36.58 7.47,37.49 6.1,38.86 | 49.53,68.58 48.34,67.39 42.3,67.39 41.59,67.39 41.23,67.03 35.69,67.03 34.14,68.58 33.07,68.58 R56.2 32.92,68.58 31.39,67.06 31.39,61.11 32.16,60.35 33.83,60.35 34.59,59.59 34.59,54.71 34.75,54.56 36.58,54.56 37.34,55.32 37.34,55.78 39.93,55.78 42.67,53.03 42.67,51.82 R20.2 42.82,51.66 42.82,50.9 43.74,49.99 43.74,47.55 | 49.53,68.58 51.51,66.6 52.88,66.6 U$32.VB | 49.53,68.58 R16.2 | 38.56,26.36 40.08,26.36 R32.2 | 38.56,26.36 R34.2 38.56,26.36 | 41.15,34.29 42.52,32.92 42.52,30.79 42.22,30.48 41.6,30.48 41.3,30.79 41.3,32.92 39.62,34.59 39.01,34.59 38.71,34.29 38.71,29.72 38.56,29.57 38.56,26.36 | 41.15,34.29 38.41,37.03 | 38.41,37.03 38.1,37.34 DA2.8 38.41,37.03 | 43.74,47.55 42.67,47.55 42.52,47.7 42.52,49.99 42.37,50.14 39.01,50.14 38.1,49.23 DA1.8 38.1,48.77 37.03,47.7 v37.03,46.94 | 53.34,54.86 53.19,54.71 51.82,54.71 50.75,53.65 50.75,52.27 49.38,50.9 46.02,50.9 45.11,49.99 45.11,47.7 44.96,47.55 43.74,47.55 | 53.34,54.86 53.95,55.47 53.95,57.3 52.73,58.52 52.73,59.13 R9.2 | 41.15,34.29 43.89,37.03 43.89,39.17 46.02,41.3 46.18,41.3 46.33,41.45 46.33,44.5 53.65,51.82 53.65,54.56 53.34,54.86 | v27.74,40.08 v27.73,40.08
  Top 0.203: 13.2,46.1 12.81,46.1 11.45,44.74 11.45,44.68 11.3,44.53 11.24,44.53 C4.+ | IC1.2 11.68,47.62 13.2,46.1 | 20.11,41.29 18.3,41.29 18.15,41.44 18.15,44.16 16.5,45.8 14.1,45.8 13.79,46.1 13.2,46.1 | 21.9,42.52 21.33,42.52 20.11,41.29 | R37.1 20.11,40.92 20.11,41.29 | IC2.3 29.19,39.45 28.36,39.45 v27.73,40.08 26.51,41.3 24.45,41.3
  Bottom 0.152: v27.74,40.08 34.59,46.94 v37.03,46.94